# Altium schematic sheet Tx_leds.SchDoc: Balise IR-Tx - LEDs
size A3; Author: B Labbe; CompanyName: Oufffteam; DrawnBy: B Labbe; Engineer: B Labbe; Organization: Oufffteam; Address1: L3, 12a Rodborough Rd; Address2: Frenchs Forest; Address3: NSW; Address4: Australia 2086; Revision: B; SheetNumber: 3; SheetTotal: 3; DocumentName: Balise IR-Tx - LEDs
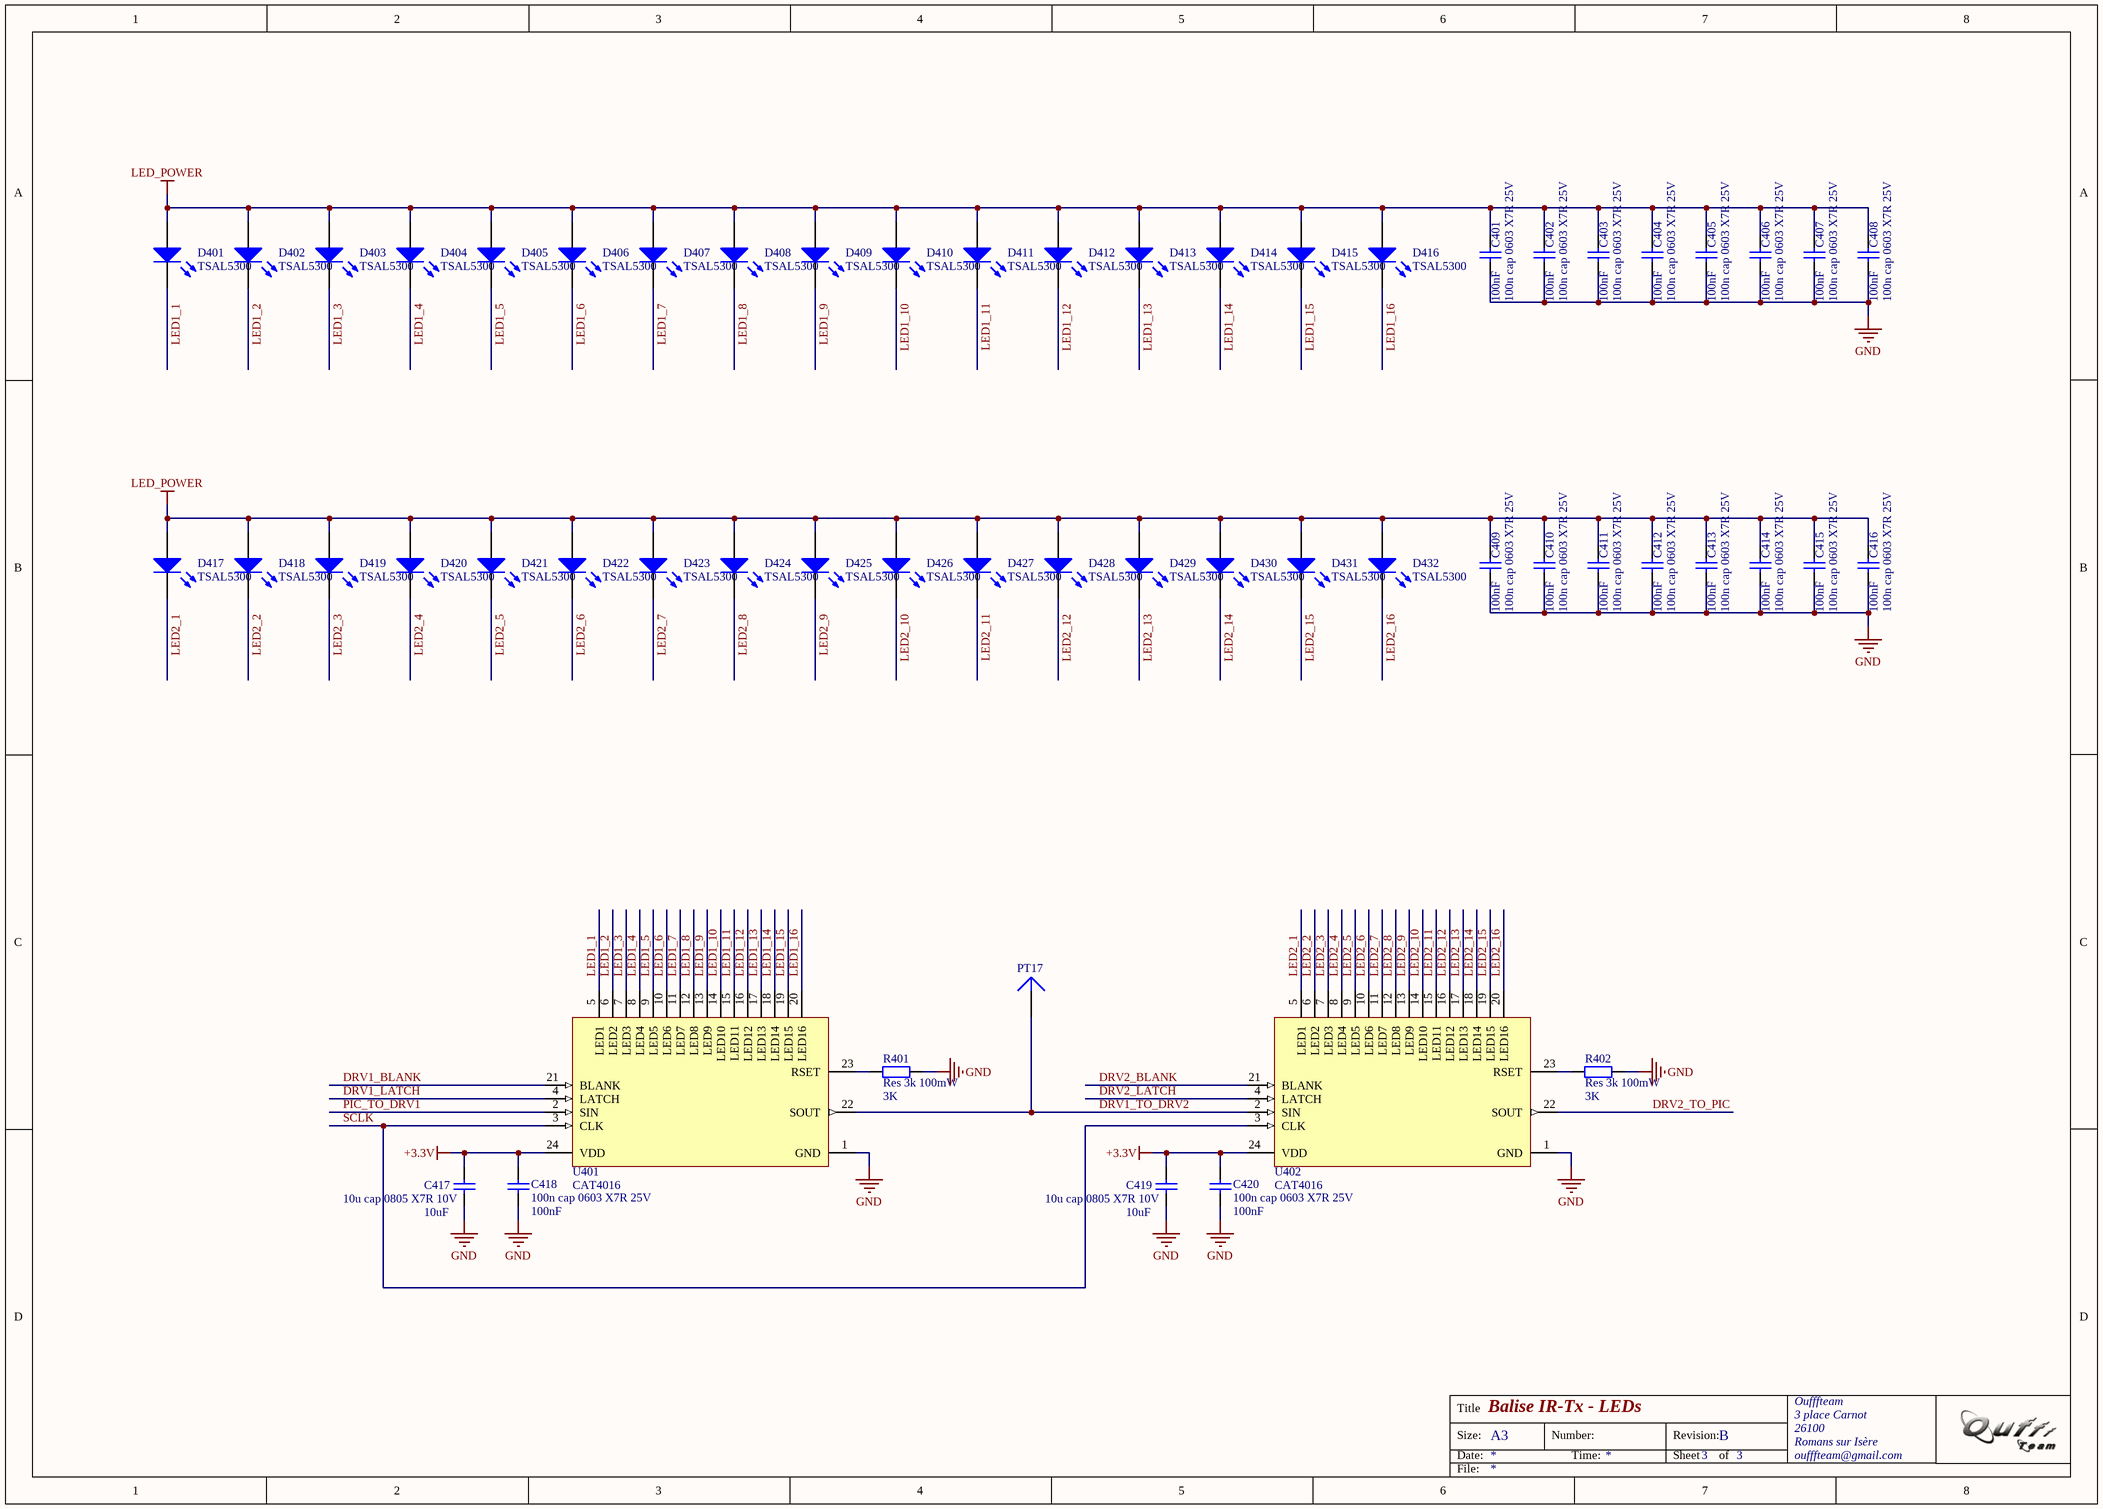
[diagram p0: Tx_leds.SchDoc]

## Parts
C401  100n cap 0603 X7R 25V  value 100nF  [0603]
C402  100n cap 0603 X7R 25V  value 100nF  [0603]
C403  100n cap 0603 X7R 25V  value 100nF  [0603]
C404  100n cap 0603 X7R 25V  value 100nF  [0603]
C405  100n cap 0603 X7R 25V  value 100nF  [0603]
C406  100n cap 0603 X7R 25V  value 100nF  [0603]
C407  100n cap 0603 X7R 25V  value 100nF  [0603]
C408  100n cap 0603 X7R 25V  value 100nF  [0603]
C409  100n cap 0603 X7R 25V  value 100nF  [0603]
C410  100n cap 0603 X7R 25V  value 100nF  [0603]
C411  100n cap 0603 X7R 25V  value 100nF  [0603]
C412  100n cap 0603 X7R 25V  value 100nF  [0603]
C413  100n cap 0603 X7R 25V  value 100nF  [0603]
C414  100n cap 0603 X7R 25V  value 100nF  [0603]
C415  100n cap 0603 X7R 25V  value 100nF  [0603]
C416  100n cap 0603 X7R 25V  value 100nF  [0603]
C417  10u cap 0805 X7R 10V  value 10uF  [0805]
C418  100n cap 0603 X7R 25V  value 100nF  [0603]
C419  10u cap 0805 X7R 10V  value 10uF  [0805]
C420  100n cap 0603 X7R 25V  value 100nF  [0603]
D401  TSAL5300  [LED-1]
D402  TSAL5300  [LED-1]
D403  TSAL5300  [LED-1]
D404  TSAL5300  [LED-1]
D405  TSAL5300  [LED-1]
D406  TSAL5300  [LED-1]
D407  TSAL5300  [LED-1]
D408  TSAL5300  [LED-1]
D409  TSAL5300  [LED-1]
D410  TSAL5300  [LED-1]
D411  TSAL5300  [LED-1]
D412  TSAL5300  [LED-1]
D413  TSAL5300  [LED-1]
D414  TSAL5300  [LED-1]
D415  TSAL5300  [LED-1]
D416  TSAL5300  [LED-1]
D417  TSAL5300  [LED-1]
D418  TSAL5300  [LED-1]
D419  TSAL5300  [LED-1]
D420  TSAL5300  [LED-1]
D421  TSAL5300  [LED-1]
D422  TSAL5300  [LED-1]
D423  TSAL5300  [LED-1]
D424  TSAL5300  [LED-1]
D425  TSAL5300  [LED-1]
D426  TSAL5300  [LED-1]
D427  TSAL5300  [LED-1]
D428  TSAL5300  [LED-1]
D429  TSAL5300  [LED-1]
D430  TSAL5300  [LED-1]
D431  TSAL5300  [LED-1]
D432  TSAL5300  [LED-1]
PT17  Plug  [TP]  (value not drawn)
R401  Res 3k 100mW  value 3K  [0603]
R402  Res 3k 100mW  value 3K  [0603]
U401  CAT4016  [TSSOP65P640X120-24L]
U402  CAT4016  [TSSOP65P640X120-24L]

## Nets
+3.3V: C417.2 C418.2 C419.2 C420.2 U401.24(VDD) U402.24(VDD)
GND: C401.1 C402.1 C403.1 C404.1 C405.1 C406.1 C407.1 C408.1 C409.1 C410.1 C411.1 C412.1 C413.1 C414.1 C415.1 C416.1 C417.1 C418.1 C419.1 C420.1 R401.2 R402.2 U401.1(GND) U402.1(GND)
LED_POWER: C401.2 C402.2 C403.2 C404.2 C405.2 C406.2 C407.2 C408.2 C409.2 C410.2 C411.2 C412.2 C413.2 C414.2 C415.2 C416.2 D401.1(A) D402.1(A) D403.1(A) D404.1(A) D405.1(A) D406.1(A) D407.1(A) D408.1(A) D409.1(A) D410.1(A) D411.1(A) D412.1(A) D413.1(A) D414.1(A) D415.1(A) D416.1(A) D417.1(A) D418.1(A) D419.1(A) D420.1(A) D421.1(A) D422.1(A) D423.1(A) D424.1(A) D425.1(A) D426.1(A) D427.1(A) D428.1(A) D429.1(A) D430.1(A) D431.1(A) D432.1(A)
DRV1_BLANK: U401.21(BLANK)
DRV1_LATCH: U401.4(LATCH)
DRV1_TO_DRV2: PT17.1 U401.22(SOUT) U402.2(SIN)
DRV2_BLANK: U402.21(BLANK)
DRV2_LATCH: U402.4(LATCH)
DRV2_TO_PIC: U402.22(SOUT)
LED1_1: D401.2(K) U401.5(LED1)
LED1_2: D402.2(K) U401.6(LED2)
LED1_3: D403.2(K) U401.7(LED3)
LED1_4: D404.2(K) U401.8(LED4)
LED1_5: D405.2(K) U401.9(LED5)
LED1_6: D406.2(K) U401.10(LED6)
LED1_7: D407.2(K) U401.11(LED7)
LED1_8: D408.2(K) U401.12(LED8)
LED1_9: D409.2(K) U401.13(LED9)
LED1_10: D410.2(K) U401.14(LED10)
LED1_11: D411.2(K) U401.15(LED11)
LED1_12: D412.2(K) U401.16(LED12)
LED1_13: D413.2(K) U401.17(LED13)
LED1_14: D414.2(K) U401.18(LED14)
LED1_15: D415.2(K) U401.19(LED15)
LED1_16: D416.2(K) U401.20(LED16)
LED2_1: D417.2(K) U402.5(LED1)
LED2_2: D418.2(K) U402.6(LED2)
LED2_3: D419.2(K) U402.7(LED3)
LED2_4: D420.2(K) U402.8(LED4)
LED2_5: D421.2(K) U402.9(LED5)
LED2_6: D422.2(K) U402.10(LED6)
LED2_7: D423.2(K) U402.11(LED7)
LED2_8: D424.2(K) U402.12(LED8)
LED2_9: D425.2(K) U402.13(LED9)
LED2_10: D426.2(K) U402.14(LED10)
LED2_11: D427.2(K) U402.15(LED11)
LED2_12: D428.2(K) U402.16(LED12)
LED2_13: D429.2(K) U402.17(LED13)
LED2_14: D430.2(K) U402.18(LED14)
LED2_15: D431.2(K) U402.19(LED15)
LED2_16: D432.2(K) U402.20(LED16)
PIC_TO_DRV1: U401.2(SIN)
SCLK: U401.3(CLK) U402.3(CLK)
NetR401_1: R401.1 U401.23(RSET)
NetR402_1: R402.1 U402.23(RSET)

## Notes on the sheet
- Title
- Size:
- Date:
- A3
- Number:
- Time:
- Revision:
- Sheet
- of
- Oufffteam
- 3 place Carnot
- 26100
- Romans sur Isère
- oufffteam@gmail.com
- File:

## Library data of the parts
C401-C420 = Cap: Capacitor; Published: 8-Jun-2000; LatestRevisionDate: 17-Jul-2002; LatestRevisionNote: Re-released for DXP Platform.; PackageReference: RAD-0.3; Publisher: Altium Limited
D401-D432 = LED1: Typical RED GaAs LED; Published: 8-Jun-2000; LatestRevisionDate: 08-Jul-2005; LatestRevisionNote: Mech Layer 1 removed.; PackageReference: LED-1; Publisher: Altium Limited
R401 R402 = Res2: Resistor; Published: 8-Jun-2000; LatestRevisionDate: 17-Jul-2002; LatestRevisionNote: Re-released for DXP Platform.; PackageReference: AXIAL-0.4; Publisher: Altium Limited
U401 U402 = CAT4016: 16-Channel Constant Current LED Driver
PT17 = Plug: LatestRevisionDate: 17-Jul-2002; LatestRevisionNote: Re-released for DXP Platform.; Publisher: Altium Limited